# EAGLE design Shield (EAGLE 7.2.0)
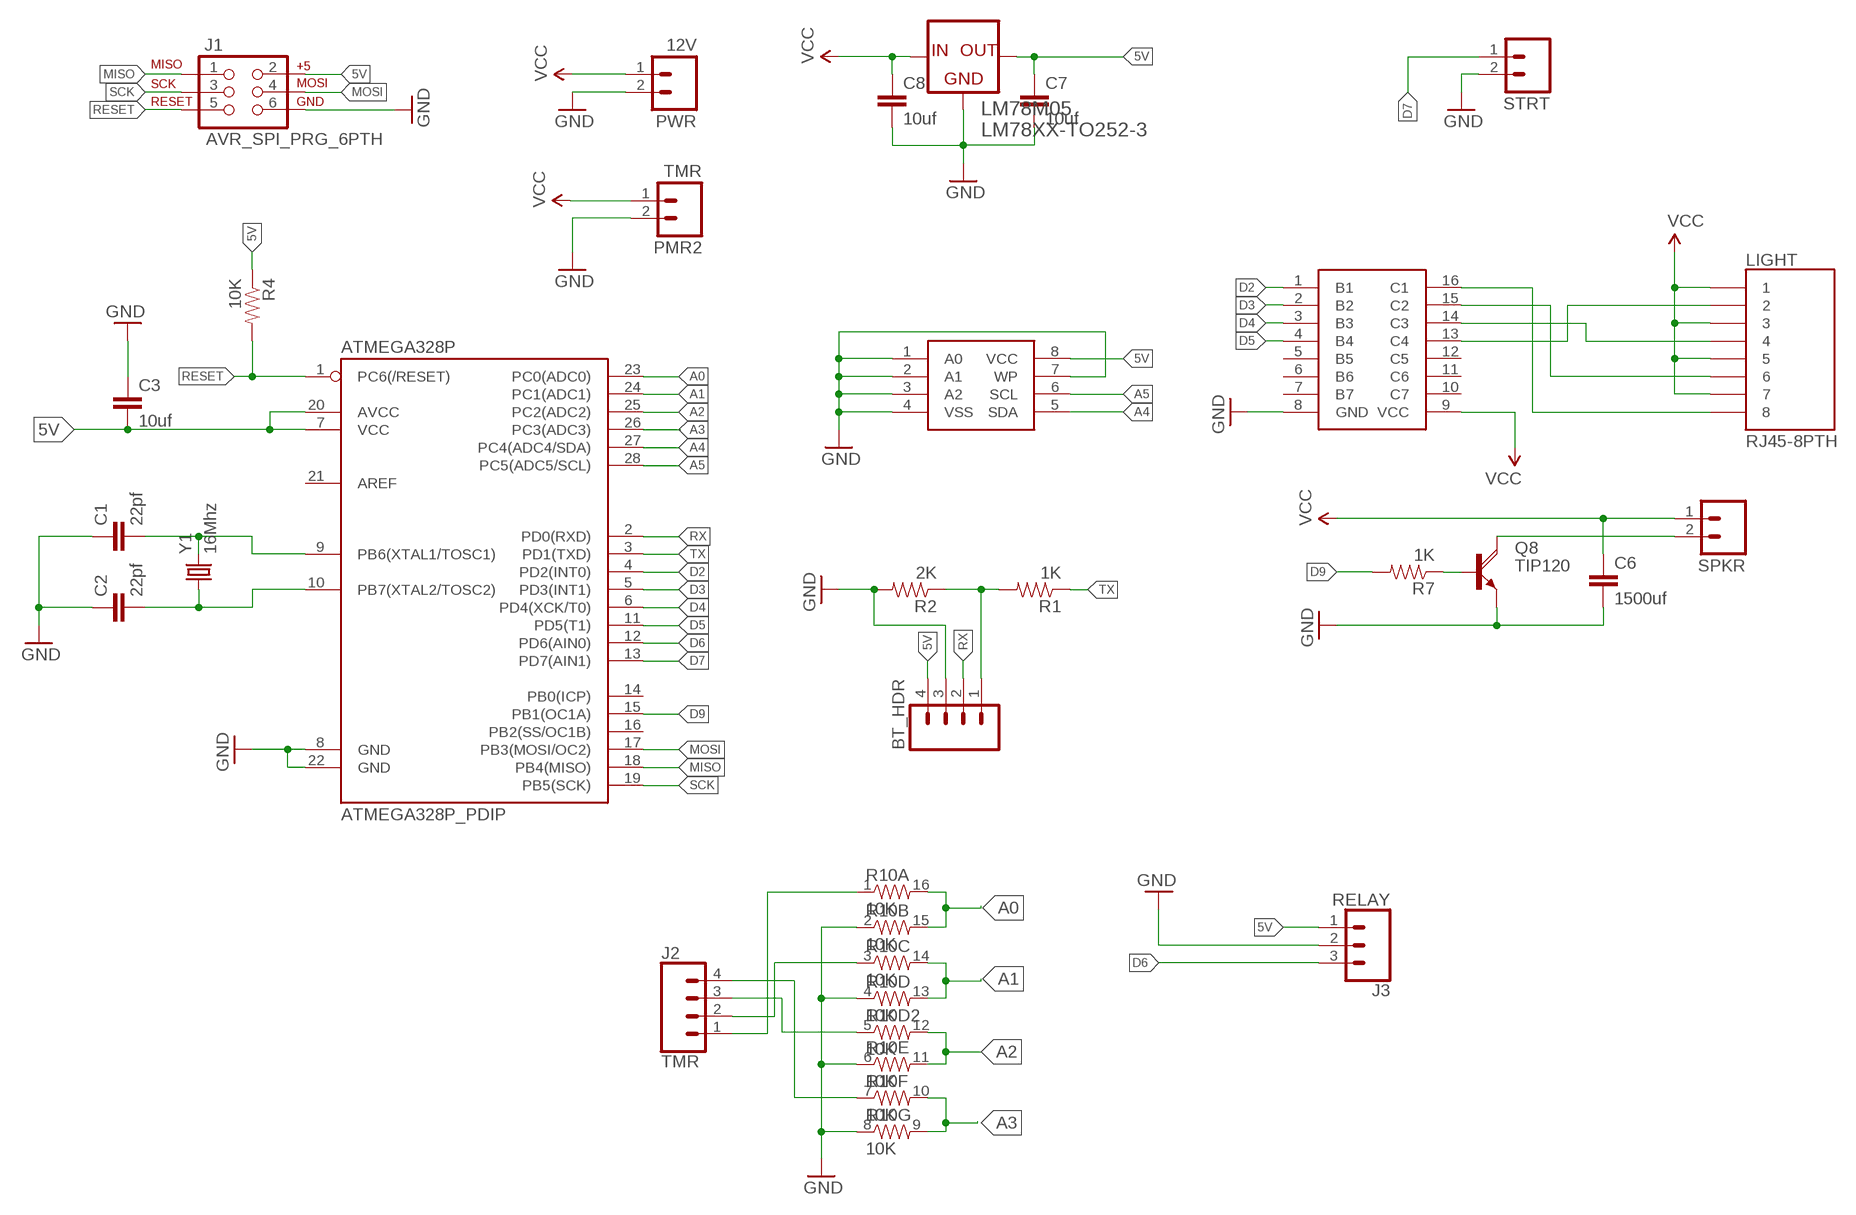
[diagram p0: schematic, sheet 1]

## Parts
24AA512  24AAXXX  [SOIC-8-EIAJ]
ATMEGA328P  ATMEGA328P_PDIP  [DIL28-3]
BT_HDR  M04PTH  [1X04@1]
C1  22pf  CAP1206  [1206]
C2  22pf  CAP1206  [1206]
C3  10uf  CAP1206  [1206]
C6  1500uf  CAPPTH1  [CAP-PTH-5MM]
C7  10uf  CAPPTH  [CAP-PTH-SMALL]
C8  10uf  CAPPTH  [CAP-PTH-SMALL]
J1  AVR_SPI_PRG_6PTH  [2X3]
J2  TMR  CONN_04SCREW  [SCREWTERMINAL-3.5MM-4]
J3  RELAY  CONN_03SCREW  [SCREWTERMINAL-3.5MM-3]
LIGHT  RJ45-8PTH  [RJ45-8]
LM78M05  LM78XX-TO252-3  [TO252-3]
MC1413D  MC1413D  [SO016]
PMR2  TMR  M023.5MM  [SCREWTERMINAL-3.5MM-2]
PWR  12V  M023.5MM  [SCREWTERMINAL-3.5MM-2]
Q8  TIP120  [TO220V]
R1  1K  RESISTOR1206  [1206]
R2  2K  RESISTOR1206  [1206]
R4  10K  RESISTOR1206  [1206]
R7  1K  RESISTOR1206  [1206]
R10  10K  RESISTOR-ARRAY  [SO016]
SPKR  M023.5MM  [SCREWTERMINAL-3.5MM-2]
STRT  M023.5MM  [SCREWTERMINAL-3.5MM-2]
Y1  16Mhz  CRYSTALHC49US  [HC49US]

## Nets
5V: 24AA512.8(VCC) ATMEGA328P.7(VCC) ATMEGA328P.20(AVCC) BT_HDR.4 C3.2 C7.1 J1.2 J3.1 LM78M05.3(OUT) R4.1
A0: ATMEGA328P.23(PC0(ADC0)) R10.15 R10.16
A1: ATMEGA328P.24(PC1(ADC1)) R10.13 R10.14
A2: ATMEGA328P.25(PC2(ADC2)) R10.11 R10.12
A3: ATMEGA328P.26(PC3(ADC3)) R10.9 R10.10
A4: 24AA512.5(SDA) ATMEGA328P.27(PC4(ADC4/SDA))
A5: 24AA512.6(SCL) ATMEGA328P.28(PC5(ADC5/SCL))
D2: ATMEGA328P.4(PD2(INT0)) MC1413D.1(B1)
D3: ATMEGA328P.5(PD3(INT1)) MC1413D.2(B2)
D4: ATMEGA328P.6(PD4(XCK/T0)) MC1413D.3(B3)
D5: ATMEGA328P.11(PD5(T1)) MC1413D.4(B4)
D6: ATMEGA328P.12(PD6(AIN0)) J3.3
D7: ATMEGA328P.13(PD7(AIN1)) STRT.1
D9: ATMEGA328P.15(PB1(OC1A)) R7.2
GND: 24AA512.1(A0) 24AA512.2(A1) 24AA512.3(A2) 24AA512.4(VSS) 24AA512.7(WP) ATMEGA328P.8(GND) ATMEGA328P.22(GND) BT_HDR.3 C1.1 C2.1 C3.1 C6.2 C7.2 C8.2 J1.6 J3.2 LM78M05.2(COM) MC1413D.8(GND) PMR2.2 PWR.2 Q8.3(E) R2.2 R10.2 R10.4 R10.6 R10.8 STRT.2
MISO: ATMEGA328P.18(PB4(MISO)) J1.1
MOSI: ATMEGA328P.17(PB3(MOSI/OC2)) J1.4
N$1: BT_HDR.1 R1.2 R2.1
N$2: LIGHT.8 MC1413D.16(C1)
N$3: LIGHT.4 MC1413D.14(C3)
N$4: LIGHT.2 MC1413D.13(C4)
N$5: LIGHT.6 MC1413D.15(C2)
N$7: J2.1 R10.1
N$11: J2.4 R10.7
N$12: Q8.2(C) SPKR.2
N$15: ATMEGA328P.9(PB6(XTAL1/TOSC1)) C1.2 Y1.2
N$18: J2.2 R10.3
N$19: Q8.1(B) R7.1
N$20: J2.3 R10.5
N$24: ATMEGA328P.10(PB7(XTAL2/TOSC2)) C2.2 Y1.1
RESET: ATMEGA328P.1(PC6(/RESET)) J1.5 R4.2
RX: ATMEGA328P.2(PD0(RXD)) BT_HDR.2
SCK: ATMEGA328P.19(PB5(SCK)) J1.3
TX: ATMEGA328P.3(PD1(TXD)) R1.1
VCC: C6.1 C8.1 LIGHT.1 LIGHT.3 LIGHT.5 LIGHT.7 LM78M05.1(IN) MC1413D.9(VCC) PMR2.1 PWR.1 SPKR.1
Unconnected: ATMEGA328P.14(PB0(ICP)) ATMEGA328P.16(PB2(SS/OC1B)) ATMEGA328P.21(AREF) MC1413D.5(B5) MC1413D.6(B6) MC1413D.7(B7) MC1413D.10(C7) MC1413D.11(C6) MC1413D.12(C5)

## Library data of the parts
24AA512 = ucigate:24AAXXX
ATMEGA328P = SparkFun-DigitalIC:ATMEGA328P_PDIP: uC used in the Arduino 32kb flash, 1k EEPROM, 2k SRAM This is the through-hole version of this chip.
BT_HDR = SparkFun-Connectors:M04: Header 4 Standard 4-pin 0.1" header. Use with straight break away headers (SKU : PRT-00116), right angle break away headers (PRT-00553), swiss pins (PRT-00743), machine pins (PRT-00117), and female headers (PRT-00115). Molex polarized connector foot print use with SKU : PRT-08231 with associated crimp pins and housings. 1MM SMD Version SKU: PRT-10208
C1-C3 C6-C8 = SparkFun-Capacitors:CAP: Capacitor Standard 0603 ceramic capacitor, and 0.1" leaded capacitor.
J1 = SparkFun-Connectors:AVR_SPI_PRG_6: AVR ISP 6 Pin This is the reduced ISP connector for AVR programming. Common on Arduino. This footprint will take up less PCB space and can be used with a 10-pin to 6-pin adapter such as SKU: BOB-08508 **Special note about "TEST_POINT" package. The stop mask is on the top side, so if you want your programming test points to be on the bottom of your board, make sure to place this package on the bottom side of the board. This also ensure that the orientation to program from the bottom side will be correct.
J2 = SparkFun-Connectors:CONN_04: Multi connection point. Often used as Generic Header-pin footprint for 0.1 inch spaced/style header connections On any of the 0.1 inch spaced packages, you can populate with these: Break Away Headers - Straight <https://www.sparkfun.com/products/116> (PRT-00116) Break Away Male Headers - Right Angle <https://www.sparkfun.com/products/553> (PRT-00553) Female Headers <https://www.sparkfun.com/products/115> (PRT-00115) Break Away Headers - Machine Pin <https://www.sparkfun.com/products/117> (PRT-00117) Break Away Female Headers - Swiss Machine Pin <https://www.sparkfun.com/products/743> (PRT-00743) For SCREWTERMINALS and SPRING TERMINALS visit here: Screw Terimnals on SparkFun.com <https://www.sparkfun.com/search/results?term=Screw+Terminals> (5mm/3.5mm/2.54mm spacing) This device is also useful as a general connection point to wire up your design to another part of your project. Our various solder wires solder well into these plated through hole pads. Hook-Up Wire - Assortment (Stranded, 22 AWG) <https://www.sparkfun.com/products/11375> (PRT-11375) Hook-Up Wire - Assortment (Solid Core, 22 AWG) <https://www.sparkfun.com/products/11367> (PRT-11367) View the entire wire category on our website here <https://www.sparkfun.com/categories/141> Special notes: Molex polarized connector foot print use with SKU : PRT-08231 with associated crimp pins and housings. 1MM SMD Version SKU: PRT-10208; PROD_ID: 2xCONN-08399; SF_ID: 2xPRT-08084
J3 = SparkFun-Connectors:CONN_03: Multi connection point. Often used as Generic Header-pin footprint for 0.1 inch spaced/style header connections On any of the 0.1 inch spaced packages, you can populate with these: Break Away Headers - Straight <https://www.sparkfun.com/products/116> (PRT-00116) Break Away Male Headers - Right Angle <https://www.sparkfun.com/products/553> (PRT-00553) Female Headers <https://www.sparkfun.com/products/115> (PRT-00115) Break Away Headers - Machine Pin <https://www.sparkfun.com/products/117> (PRT-00117) Break Away Female Headers - Swiss Machine Pin <https://www.sparkfun.com/products/743> (PRT-00743) Stackable Header - 3 Pin (Female, 0.1") <https://www.sparkfun.com/products/13875> (PRT-13875) For SCREWTERMINALS and SPRING TERMINALS visit here: Screw Terimnals on SparkFun.com <https://www.sparkfun.com/search/results?term=Screw+Terminals> (5mm/3.5mm/2.54mm spacing) This device is also useful as a general connection point to wire up your design to another part of your project. Our various solder wires solder well into these plated through hole pads. Hook-Up Wire - Assortment (Stranded, 22 AWG) <https://www.sparkfun.com/products/11375> (PRT-11375) Hook-Up Wire - Assortment (Solid Core, 22 AWG) <https://www.sparkfun.com/products/11367> (PRT-11367) View the entire wire category on our website here <https://www.sparkfun.com/categories/141> Special notes: Molex polarized connector foot print use with SKU : PRT-08232 with associated crimp pins and housings.; PROD_ID: CONN-08288; SF_ID: PRT-08235
LIGHT = SparkFun-Connectors:RJ45-8: RJ45 Jack Simple RJ45, 8-pin connection - connector for common Cat5, Cat5e, and Cat6 Ethernet cables. Footprint not yet proven in production. Connector sku is PRT-00643; Breakout PCB sku is BOB-00716.
LM78M05 = element14-com:LM78XX-TO252-3: IC, POSITIVE-VOLTAGE REGULATORS, 3.3V, 3-TO-252; MPN: UA78M33CKVURG3; OC_FARNELL: 2075446; OC_NEWARK: 80K3502; PACKAGE: 3-TO-252; SUPPLIER: TEXAS INSTRUMENTS
MC1413D = ucigate:MC1413D
PMR2 PWR SPKR STRT = SparkFun-Connectors:M02: Header 2 Standard 2-pin 0.1" header. Use with straight break away headers (SKU : PRT-00116), right angle break away headers (PRT-00553), swiss pins (PRT-00743), machine pins (PRT-00117), and female headers (PRT-00115). Molex polarized connector foot print use with SKU : PRT-08233 with associated crimp pins and housings.
Q8 = ucigate:TIP120: NPN DARLINGTON TRANSISTOR
R1 R2 R4 R7 = SparkFun-Passives:RESISTOR: Resistor Basic schematic elements and footprints for 0603, 1206, and PTH resistors.
R10 = petrocik:RESISTOR-ARRAY: Array Chip Resistor Source: RS Component / Phycomp
Y1 = SparkFun-FreqCtrl:CRYSTAL: Various standard crystals. Proven footprints. Spark Fun Electronics SKU : COM-00534

## Net classes
0 default: width 0.254 mm

## Board
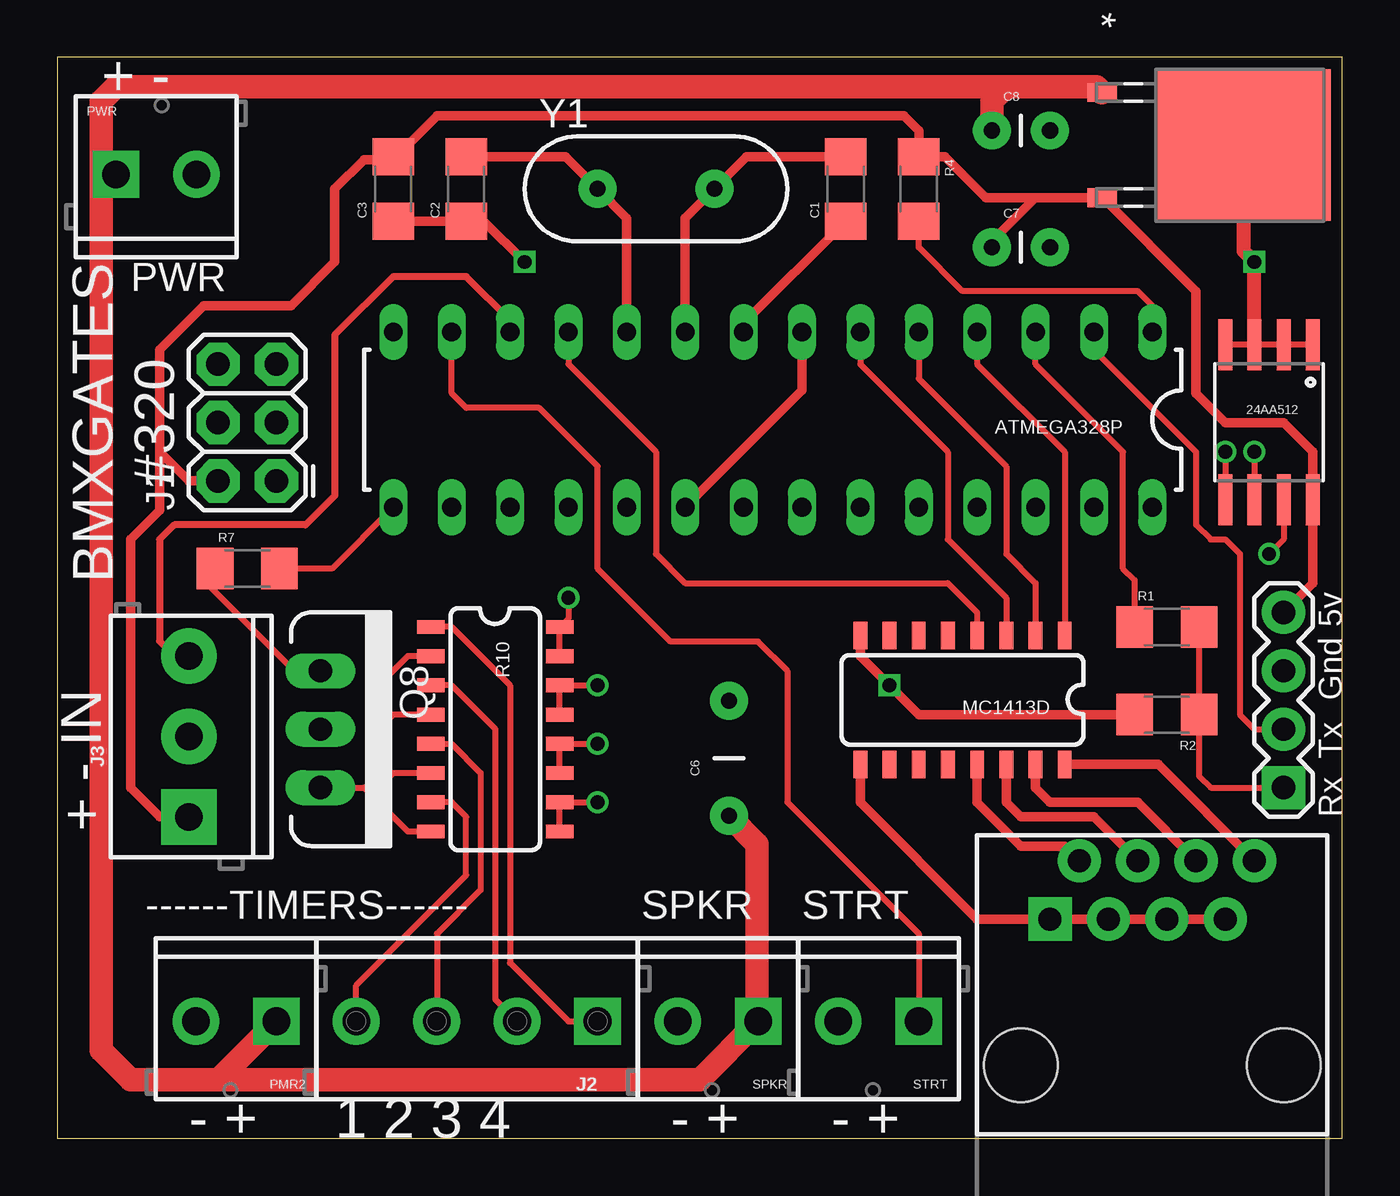
[diagram p1: board, top side]
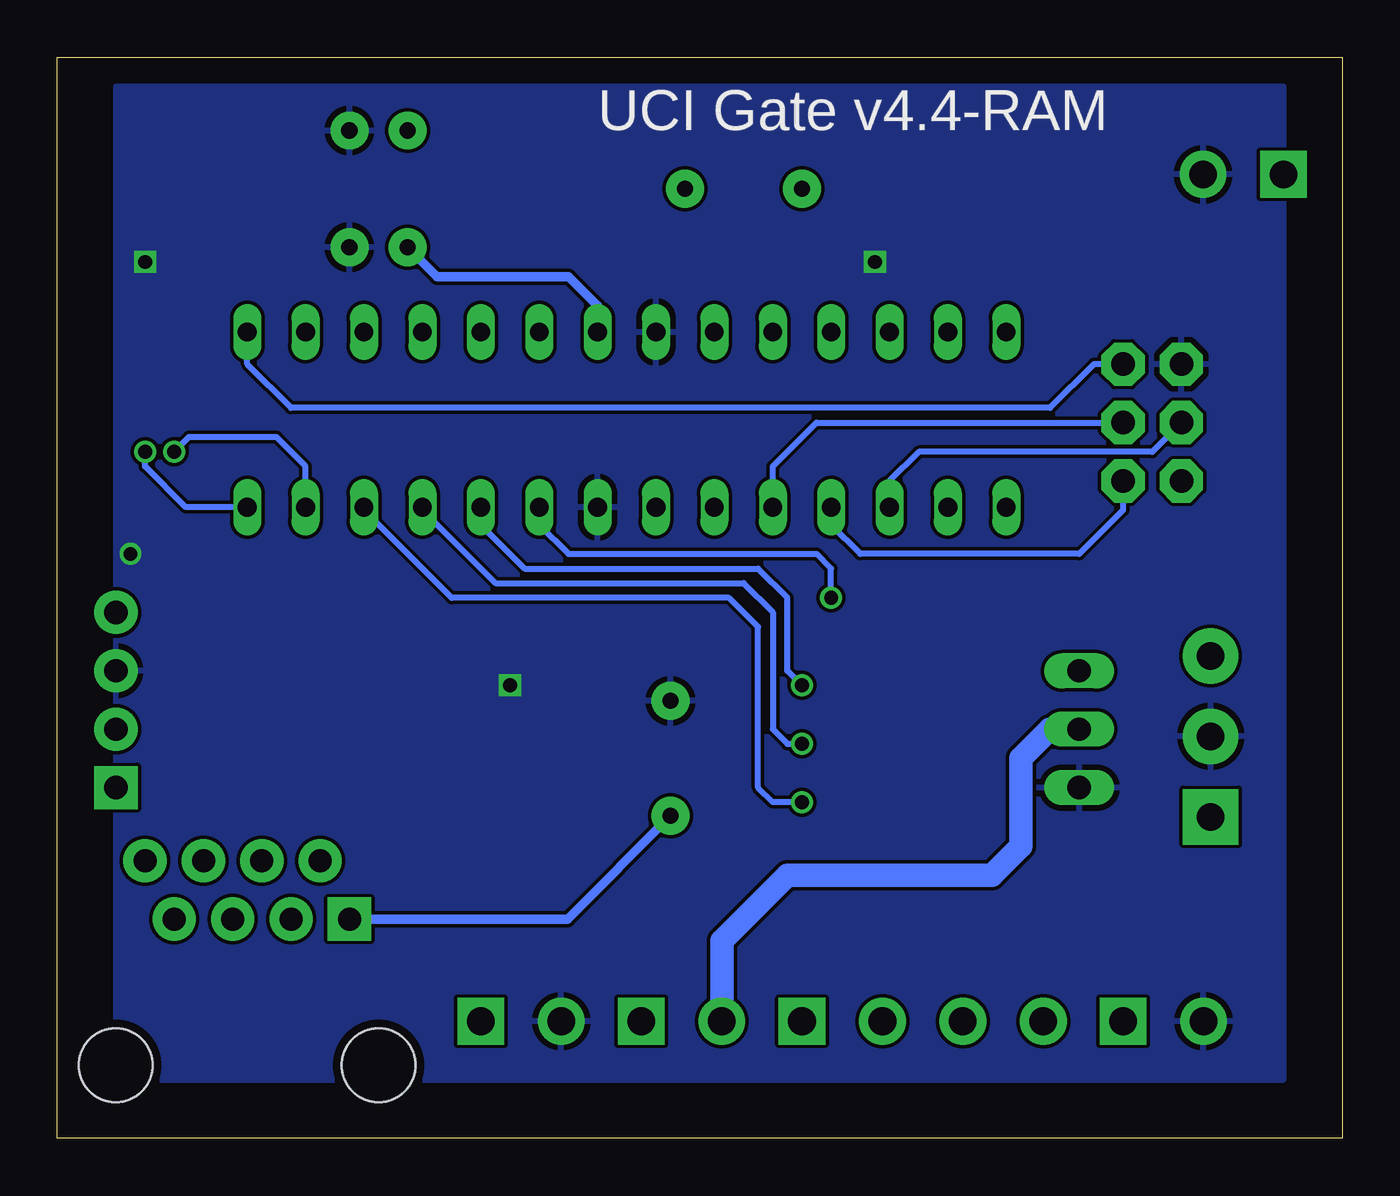
[diagram p2: board, bottom side, seen from below]

Size 55.88 x 46.99 mm. Coordinates in mm from the lower left corner, seen from the top.
Outline: 0,0 55.88,0 55.88,46.99 0,46.99 0,0
Copper layers (1*16): Top 0.0356mm / dielectric 1.5011mm / Bottom 0.0356mm
Design rules "LaenPCBOrder": minimum track width 6mil, minimum drill 13mil, track to track 6mil, track to pad 6mil, pad to pad 6mil, via to via 6mil, smd to smd 6mil, copper to edge 15mil, drill to drill 6mil, minimum pad ring 7mil, minimum via ring 7mil, stop-mask expansion 4mil, vias tented up to drill 0mil, thermal gap 10mil

### Footprints (pad centres in the part's own frame; a part is rotated, then mirrored left to right if it is on the bottom)
SOIC-8-EIAJ = smd 0.61 x 2.21: 1 -1.905,-3.378; 2 -0.635,-3.378; 3 0.635,-3.378; 4 1.905,-3.378; 5 1.905,3.353; 6 0.635,3.353; 7 -0.635,3.353; 8 -1.905,3.353
DIL28-3 = drill 0.813 long: 1 -16.51,-3.81; 2 -13.97,-3.81; 3 -11.43,-3.81; 4 -8.89,-3.81; 5 -6.35,-3.81; 6 -3.81,-3.81; 7 -1.27,-3.81; 8 1.27,-3.81; 9 3.81,-3.81; 10 6.35,-3.81; 11 8.89,-3.81; 12 11.43,-3.81; 13 13.97,-3.81; 14 16.51,-3.81; 15 16.51,3.81; 16 13.97,3.81; 17 11.43,3.81; 18 8.89,3.81; 19 6.35,3.81; 20 3.81,3.81; 21 1.27,3.81; 22 -1.27,3.81; 23 -3.81,3.81; 24 -6.35,3.81; 25 -8.89,3.81; 26 -11.43,3.81; 27 -13.97,3.81; 28 -16.51,3.81
1X04@1 = drill 1.016 pad 1.88 square: 1 0,0 | drill 1.016 pad 1.88: 2 2.54,0; 3 5.08,0; 4 7.62,0
1206 = smd 1.6 x 1.8: 1 -1.4,0; 2 1.4,0
CAP-PTH-5MM = drill 0.7 pad 1.651: 1 -2.5,0; 2 2.5,0
CAP-PTH-SMALL = drill 0.7 pad 1.651: 1 0,0; 2 2.54,0
2X3 = drill 1.016 pad 1.88 octagon: 1 0,0; 2 0,2.54; 3 2.54,0; 4 2.54,2.54; 5 5.08,0; 6 5.08,2.54
SCREWTERMINAL-3.5MM-4 = drill 1.2 pad 2.032 square: 1 0,0 | drill 1.2 pad 2.032: 2 3.5,0; 3 7,0; 4 10.5,0
SCREWTERMINAL-3.5MM-3 = drill 1.2 pad 2.413 square: 1 0,0 | drill 1.2 pad 2.413: 2 3.5,0; 3 7,0
RJ45-8 = drill 1 pad 1.88 square: 1 -4.445,6.35 | drill 1 pad 1.88: 2 -3.175,8.89; 3 -1.905,6.35; 4 -0.635,8.89; 5 0.635,6.35; 6 1.905,8.89; 7 3.175,6.35; 8 4.445,8.89 | hole 3.2: -5.715,0; 5.715,0
TO252-3 = smd 0.813 x 1.27: 1 -2.286,-5.994; 3 2.286,-5.994 | smd 6.579 x 7.595: 2 0,0.152
SO016 = smd 0.6 x 1.2: 1 -4.445,-2.8; 2 -3.175,-2.8; 3 -1.905,-2.8; 4 -0.635,-2.8; 5 0.635,-2.8; 6 1.905,-2.8; 7 3.175,-2.8; 8 4.445,-2.8; 9 4.445,2.8; 10 3.175,2.8; 11 1.905,2.8; 12 0.635,2.8; 13 -0.635,2.8; 14 -1.905,2.8; 15 -3.175,2.8; 16 -4.445,2.8
SCREWTERMINAL-3.5MM-2 = drill 1.2 pad 2.032 square: 1 0,0 | drill 1.2 pad 2.032: 2 3.5,0
TO220V = drill 1.016 long: 1 -2.54,0; 2 0,0; 3 2.54,0
HC49US = drill 0.7 pad 1.651: 1 -2.54,0; 2 2.54,0

### Placement (x,y rotation side)
24AA512  52.7,31.11 180 top
ATMEGA328P  31.12,31.24 180 top
BT_HDR  53.34,15.24 90 top
C1  34.29,41.27 90 top
C2  17.78,41.27 90 top
C3  14.6,41.27 90 top
C6  29.21,16.51 90 top
C7  40.64,38.73 0 top
C8  40.64,43.81 0 top
J1  9.52,28.57 90 top
J2  23.49,5.08 180 top
J3  5.71,13.97 90 top
LIGHT  47.62,3.17 0 top
LM78M05  51.44,43.18 270 top
MC1413D  39.37,19.05 180 top
PMR2  9.52,5.08 180 top
PWR  2.54,41.91 0 top
Q8  11.43,17.78 270 top
R1  48.26,22.23 0 top
R2  48.26,18.41 180 top
R4  37.46,41.27 270 top
R7  8.25,24.77 0 top
R10  19.05,17.78 270 top
SPKR  30.48,5.08 180 top
STRT  37.46,5.08 180 top
Y1  26.03,41.27 0 top

### Tracks (layer width: path | path; a pad name or v marks a point on that pad's centre or on a via)
5V
  Top 0.406: BT_HDR.4 54.61,24.13 24AA512.8 54.61,29.84 53.34,31.11 50.8,31.11 49.53,32.38 49.53,36.83 45.47,40.89 LM78M05.3 42.55,40.89 | 4.45,29.84 4.45,27.3 3.17,26.04 3.17,15.24 4.45,13.97 J3.1 | 4.45,29.84 4.45,34.29 6.35,36.2 10.16,36.2 12.06,38.1 12.06,41.27 13.33,42.55 14.48,42.55 C3.2 14.73,42.67 16.51,44.45 36.83,44.45 37.46,43.81 R4.1 38.6,42.67 40.39,40.89 42.55,40.89 | ATMEGA328P.7 32.38,32.51 ATMEGA328P.20 | C7.1 40.64,38.99 42.55,40.89 | J1.2 5.71,28.57 4.45,29.84
  Bottom 0.406: C7.1 39.37,37.47 33.66,37.47 32.38,36.2 ATMEGA328P.7
A0  (via drill 0.6)
  Top 0.254: R10.15 R10.16 22.23,22.6 v22.23,23.5
  Bottom 0.254: ATMEGA328P.23 34.92,26.67 33.66,25.4 22.86,25.4 22.23,24.77 v22.23,23.5
A1  (via drill 0.6)
  Top 0.254: R10.13 R10.14 v23.49,19.68
  Bottom 0.254: ATMEGA328P.24 37.46,26.67 35.56,24.77 25.4,24.77 24.13,23.5 24.13,20.32 v23.49,19.68
A2  (via drill 0.6)
  Top 0.254: R10.11 R10.12 v23.49,17.14
  Bottom 0.254: ATMEGA328P.25 40,27.3 36.83,24.13 26.03,24.13 24.77,22.86 24.77,17.78 24.13,17.14 v23.49,17.14
A3  (via drill 0.6)
  Top 0.254: R10.9 R10.10 v23.49,14.61
  Bottom 0.254: ATMEGA328P.26 42.55,27.3 38.73,23.5 26.67,23.5 25.4,22.23 25.4,15.24 24.77,14.61 v23.49,14.61
A4  (via drill 0.6)
  Top 0.254: v50.8,29.84 24AA512.5
  Bottom 0.254: ATMEGA328P.27 45.09,29.21 46.36,30.48 50.16,30.48 v50.8,29.84
A5  (via drill 0.6)
  Top 0.254: v52.07,29.84 24AA512.6
  Bottom 0.254: ATMEGA328P.28 50.29,27.43 52.07,29.21 v52.07,29.84
D2
  Top 0.254: ATMEGA328P.4 40,33.66 43.81,29.84 MC1413D.1
D3
  Top 0.254: ATMEGA328P.5 37.46,33.02 41.27,29.21 41.27,25.4 42.55,24.13 MC1413D.2
D4
  Top 0.254: ATMEGA328P.6 34.92,33.66 38.73,29.84 38.73,26.04 41.27,23.5 MC1413D.3
D5
  Top 0.254: ATMEGA328P.11 22.23,33.66 26.03,29.84 26.03,25.4 27.3,24.13 38.73,24.13 40,22.86 MC1413D.4
D6
  Top 0.305: ATMEGA328P.12 19.69,35.56 17.78,37.47 14.6,37.47 12.06,34.92 12.06,27.94 10.79,26.67 5.08,26.67 4.45,26.04 4.45,21.61 5.08,20.97 J3.3
D7
  Top 0.254: ATMEGA328P.13 17.14,32.38 17.78,31.75 20.95,31.75 23.49,29.21 23.49,24.77 26.67,21.59 30.48,21.59 31.75,20.32 31.75,14.61 37.46,8.89 STRT.1
D9
  Top 0.254: ATMEGA328P.15 11.94,24.77 R7.2
GND  (via drill 0.6)
  Top 0.254: 24AA512.1 24AA512.2 24AA512.3 24AA512.4 | 24AA512.7 53.34,26.04 v52.7,25.4 | Q8.3 13.33,15.24 13.97,14.61 | 13.97,14.61 15.24,13.34 R10.8 | R10.2 15.24,20.95 13.97,19.68 13.97,17.78 | 13.97,17.78 13.97,15.24 | 13.97,15.24 13.97,14.61 | R10.4 14.6,18.41 13.97,17.78 | R10.6 14.6,15.88 13.97,15.24
  Top 0.406: C1.1 29.84,35.43 ATMEGA328P.8 | v20.32,38.1 18.55,39.88 C2.1 C3.1 | MC1413D.8 34.92,20.95 v36.2,19.68 37.46,18.41 R2.2
  Top 0.61: 24AA512.3 v52.07,38.1 51.59,38.58 LM78M05.2
  pour Bottom: 53.34,2.54 2.54,2.54 2.54,45.72 53.34,45.72
MISO
  Bottom 0.254: J1.1 9.52,27.3 11.43,25.4 20.95,25.4 22.23,26.67 ATMEGA328P.18
MOSI
  Bottom 0.254: J1.4 8.25,29.84 18.41,29.84 19.69,28.57 ATMEGA328P.17
N$1
  Top 0.254: R1.2 R2.1 49.66,15.74 50.16,15.24 BT_HDR.1
N$2
  Top 0.406: MC1413D.16 47.89,16.25 LIGHT.8
N$3
  Top 0.406: MC1413D.14 41.27,14.61 41.91,13.97 45.09,13.97 LIGHT.4
N$4
  Top 0.406: MC1413D.13 40,14.61 41.91,12.7 43.81,12.7 LIGHT.2
N$5
  Top 0.406: MC1413D.15 42.55,15.24 43.18,14.61 46.99,14.61 LIGHT.6
N$7
  Top 0.254: R10.1 17.14,22.23 19.69,19.68 19.69,7.62 22.23,5.08 J2.1
N$11
  Top 0.254: J2.4 12.99,6.64 17.78,11.43 17.78,13.97 17.14,14.61 R10.7
N$12
  Bottom 1.016: SPKR.2 26.98,8.58 24.13,11.43 15.24,11.43 13.97,12.7 13.97,16.51 12.7,17.78 Q8.2
N$15
  Top 0.406: ATMEGA328P.9 27.3,40.01 Y1.2 29.98,42.67 C1.2
N$18
  Top 0.254: J2.2 19.05,6.03 19.05,17.78 17.14,19.68 R10.3
N$19
  Top 0.254: R7.1 6.35,24.26 10.29,20.32 Q8.1
N$20
  Top 0.254: R10.5 17.14,17.14 18.41,15.88 18.41,10.79 16.51,8.89 16.51,5.09 J2.3
N$24
  Top 0.406: ATMEGA328P.10 24.77,40.01 Y1.1 22.09,42.67 C2.2
RESET
  Top 0.254: ATMEGA328P.1 47.62,36.2 46.99,36.83 39.37,36.83 37.46,38.73 R4.2
  Bottom 0.254: J1.5 10.79,33.66 12.7,31.75 45.72,31.75 47.62,33.66 ATMEGA328P.1
RX
  Top 0.254: ATMEGA328P.2 45.09,34.29 49.53,29.84 49.53,26.67 50.16,26.04 50.8,26.04 51.44,25.4 51.44,18.41 52.07,17.78 BT_HDR.2
SCK
  Bottom 0.254: ATMEGA328P.19 24.77,29.21 22.86,31.11 J1.3
TX
  Top 0.254: R1.1 46.86,24.26 46.36,24.77 46.36,29.84 42.55,33.66 ATMEGA328P.3
VCC
  Top 0.406: LIGHT.7 LIGHT.5 LIGHT.3 LIGHT.1 40,9.53 34.92,14.61 MC1413D.9
  Top 1.016: 6.98,2.54 3.17,2.54 1.9,3.81 1.9,42.55 | 6.98,2.54 27.94,2.54 SPKR.1 30.44,5.12 30.44,12.78 C6.1 | 1.9,42.55 1.9,45.09 2.54,45.72 41.27,45.72 | 41.27,45.72 45.19,45.72 LM78M05.1 | C8.1 40.64,45.09 41.27,45.72 | PWR.1 1.9,42.55 | 6.98,2.54 PMR2.1
  Bottom 0.406: C6.1 33.7,9.53 LIGHT.1

### Text on the board
tPlace: + - | PWR | BMXGATES / #320 | 5v | Gnd | Tx | Rx | + - IN | ------TIMERS------ | SPKR | STRT | - + | 1 2 3 4 | - + | - +
bPlace: UCI Gate v4.4-RAM
tDocu: ISP